# Altium schematic sheet Adafruit MCP9600.SchDoc: Adafruit MCP9600
size 282 x 211 mm; Origin: Eagle; OriginPath: C:\Users\pdreyer\Desktop\Personal Docs\Estiaan Skripsie\Altium\Imports\Adafruit MCP9600.sch; OriginSheet: 1; SheetNumber: 1; YEAR: YEAR; COMPANY: COMPANY; DRAWN: DRAWN; Date: 22/02/2025 20:53:53; REV: REV; GateName_1: G$1; SymbolName_1: FRAME_A4; LibraryName: microbuilder; DeviceSetName: FRAME_A4; GateName_2: G$3; SymbolName_2: FRAME_DOCFIELD; DRG: DRG; o: o; N: N; C: C; ISSUE: ISSUE; FILE: FILE:; PAGE: PAGE:; CHECKED: CHECKED; DRGNO: >DRGNO
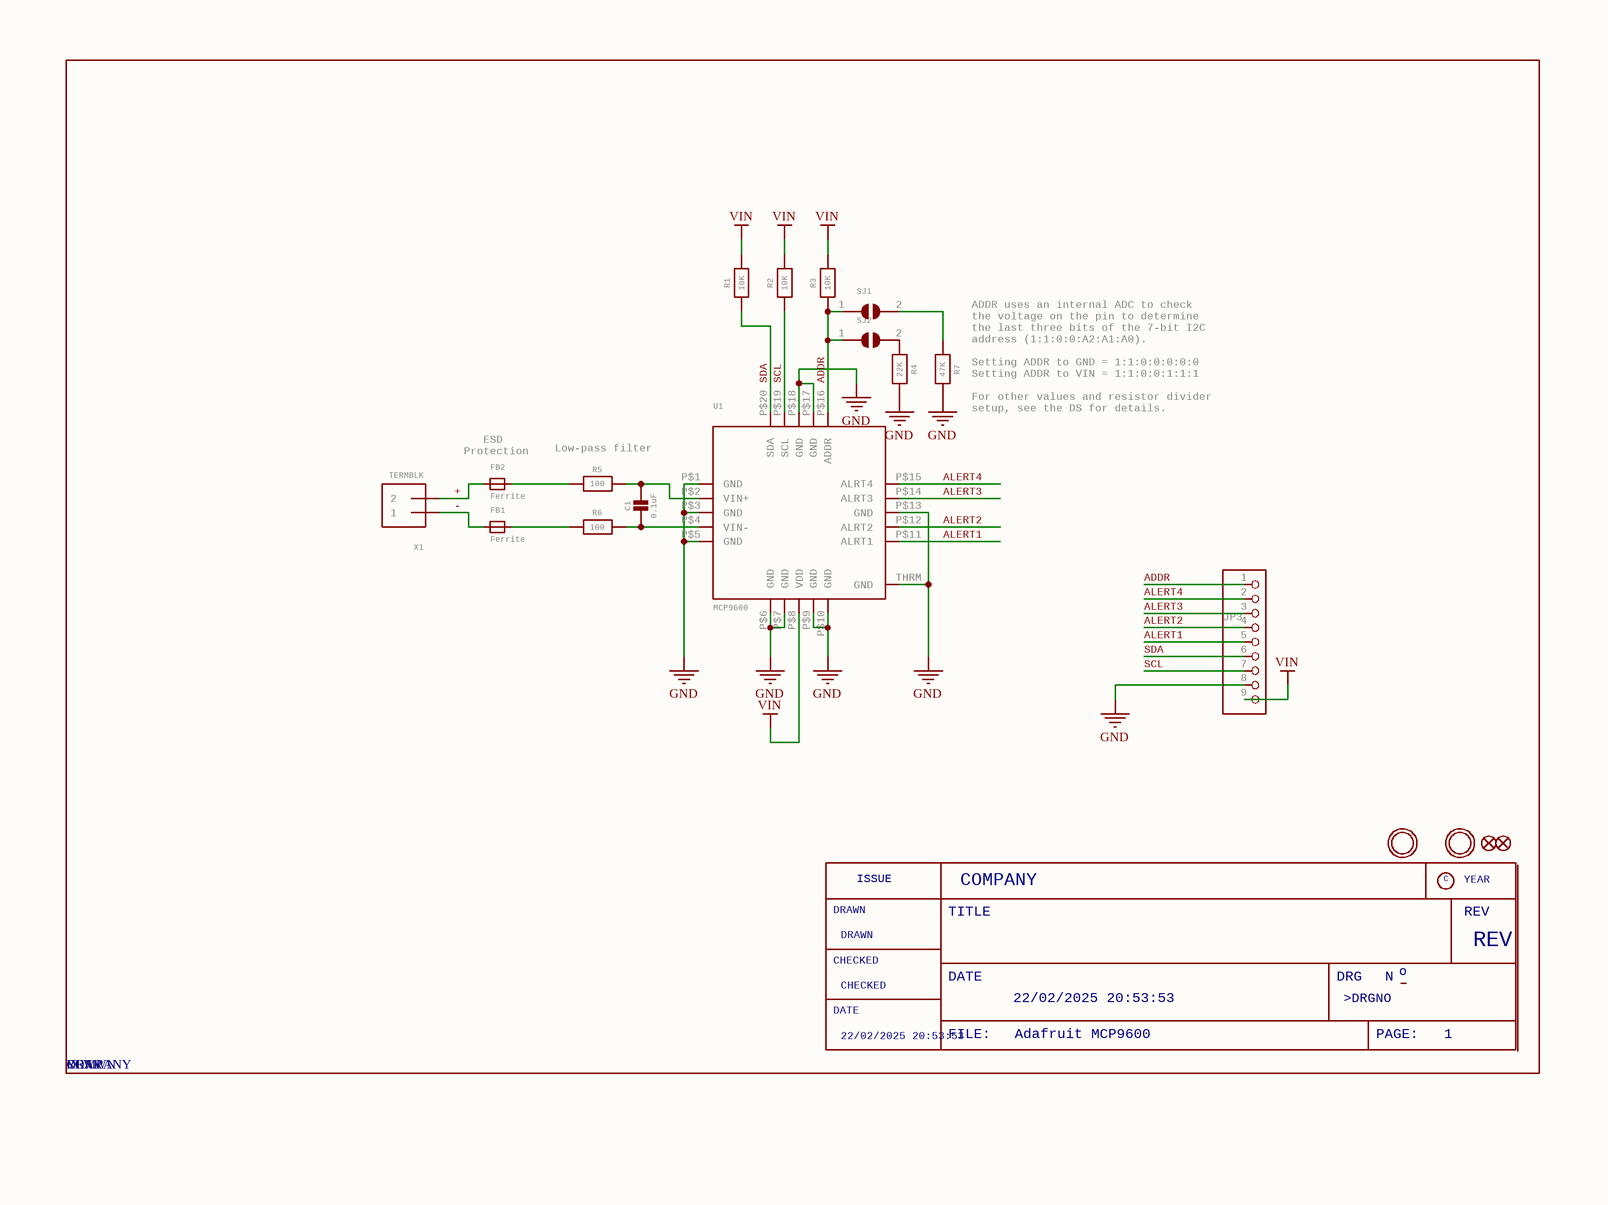
[diagram p0: Adafruit MCP9600.SchDoc]

## Parts
C1  0.1uF  [0603-NO]
FB1  Ferrite  [0805-NO]
FB2  Ferrite  [0805-NO]
FID1  FIDUCIAL_1MM  [FIDUCIAL_1MM]  (value not drawn)
FID2  FIDUCIAL_1MM  [FIDUCIAL_1MM]  (value not drawn)
JP3  HEADER-1X970MIL  [1X09_ROUND_70]  (value not drawn)
R1  10K  [0603-NO]
R2  10K  [0603-NO]
R3  10K  [0603-NO]
R4  22K  [0603-NO]
R5  100  [0603-NO]
R6  100  [0603-NO]
R7  47K  [0603-NO]
SJ1  SOLDERJUMPER  [SOLDERJUMPER_ARROW_NOPASTE]  (value not drawn)
SJ2  SOLDERJUMPER  [SOLDERJUMPER_ARROW_NOPASTE]  (value not drawn)
U1  MCP9600  [VQFN20_5MM]
U$1  MOUNTINGHOLE2.5  [MOUNTINGHOLE_2.5_PLATED]  (value not drawn)
U$3  MOUNTINGHOLE2.5  [MOUNTINGHOLE_2.5_PLATED]  (value not drawn)
X1  TERMBLK  [TERMBLOCK_1X2-3.5MM]

## Nets
GND: JP3.8 R4.2 R7.2 U1.P$1(GND) U1.P$3(GND) U1.P$5(GND) U1.P$6(GND) U1.P$7(GND) U1.P$9(GND) U1.P$10(GND) U1.P$13(GND) U1.P$17(GND) U1.P$18(GND) U1.THRM(GND)
VIN: JP3.9 R1.2 R2.2 R3.2 U1.P$8(VDD)
+: FB2.1(P$1) X1.2
-: FB1.1(P$1) X1.1
ADDR: JP3.1 R3.1 SJ1.1 SJ2.1 U1.P$16(ADDR)
ALERT1: JP3.5 U1.P$11(ALRT1)
ALERT2: JP3.4 U1.P$12(ALRT2)
ALERT3: JP3.3 U1.P$14(ALRT3)
ALERT4: JP3.2 U1.P$15(ALRT4)
SCL: JP3.7 R2.1 U1.P$19(SCL)
SDA: JP3.6 R1.1 U1.P$20(SDA)
NetC1_1: C1.1 R5.2 U1.P$2(VIN+)
NetC1_2: C1.2 R6.2 U1.P$4(VIN-)
NetFB1_2: FB1.2(P$2) R6.1
NetFB2_2: FB2.2(P$2) R5.1
NetR4_1: R4.1 SJ2.2
NetR7_1: R7.1 SJ1.2

## Notes on the sheet
- (near R7) ADDR uses an internal ADC to check
  the voltage on the pin to determine
  the last three bits of the 7-bit I2C
  address (1:1:0:0:A2:A1:A0).
  Setting ADDR to GND = 1:1:0:0:0:0:0
  Setting ADDR to VIN = 1:1:0:0:1:1:1
  For other values and resistor divider
  setup, see the DS for details.
- (near FB2) ESD
  Protection
- Low-pass filter
- DRAWN
- ISSUE
- TITLE
- COMPANY
- C
- REV
- YEAR
- CHECKED
- DATE
- 22/02/2025 20:53:53
- DRG
- >DRGNO
- N
- o
- FILE:
- Adafruit MCP9600
- PAGE:
- 1

## Library data of the parts
C1 = CAP_CERAMIC0603_NO: Ceramic Capacitors   For new designs, use the packages preceded by an '_' character since they are more reliable:   The following footprints should be used on most boards: _0402 - Standard footprint for regular board layouts  _0603 - Standard footprint for regular board layouts  _0805 - Standard footprint for regular board layouts  _1206 - Standard footprint for regular board layouts       For extremely tight-pitch boards where space is at a premium, the following 'micro-pitch' footprints can be used (smaller pads, no silkscreen outline, etc.): _0402MP - Micro-pitch footprint for very dense/compact boards  _0603MP - Micro-pitch footprint for very dense/compact boards  _0805MP - Micro-pitch footprint for very dense/compact boards  _1206MP - Micro-pitch footprint for very dense/compact boards; GateName_1: G$1; SymbolName_1: CAPACITOR; DeviceName: 0603_NO; LibraryName: microbuilder; DeviceSetName: CAP_CERAMIC
FB1 FB2 = FERRITE-0805NO: Ferrite Bead   0603 MMZ1608B121C - 120 Ohm @ 100MHz, 600mA, 0.15 Ohm DC Resistance - Digikey: 445-2164-1-ND  BK1608HW121-T - 120 Ohm, 600mA Ferrite Chip - Digikey: 587-1876-2-ND       0805 HZ0805B272R-10 - 2.7K Ohm @ 100MHz, 200mA, 0.8 Ohm DC Resistance - Digikey: 240-2504-1-ND (see also Murata BLM21BD272SN1L)  MMZ2012Y152B - 1.5K Ohm @ 100MHz, 500mA, 0.4 Ohm DC Resistance - Digikey: 445-1560-1-ND - Mainly for high frequency (80-400MHz)  MMZ2012R102A - 1K Ohm @ 100MHz, 500mA, 0.3 Ohm DC Resistance - Digikey: 445-1555-2-ND - More general purpose (10-200MHz); GateName_1: G$1; SymbolName_1: FERRITE; DeviceName: -0805NO; LibraryName: microbuilder; DeviceSetName: FERRITE
FID1 FID2 = FIDUCIAL_1MM: Fiducial Alignment Points   Various fiducial points for machine vision alignment.; GateName_1: G$1; DeviceName: _1MM; BOM: EXCLUDE; SymbolName_1: FIDUCIAL; LibraryName: microbuilder; DeviceSetName: FIDUCIAL
JP3 = HEADER-1X970MIL: PIN HEADER; GateName_1: A; SymbolName_1: PINHD9; DeviceName: 70MIL; LibraryName: microbuilder; DeviceSetName: HEADER-1X9
R1-R7 = RESISTOR_0603_NOOUT: Resistors   For new designs, use the packages preceded by an '_' character since they are more reliable:   The following footprints should be used on most boards: _0402 - Standard footprint for regular board layouts  _0603 - Standard footprint for regular board layouts  _0805 - Standard footprint for regular board layouts  _1206 - Standard footprint for regular board layouts       For extremely tight-pitch boards where space is at a premium, the following 'micro-pitch' footprints can be used (smaller pads, no silkscreen outline, etc.): _0402MP - Micro-pitch footprint for very dense/compact boards  _0603MP - Micro-pitch footprint for very dense/compact boards  _0805MP - Micro-pitch footprint for very dense/compact boards  _1206MP - Micro-pitch footprint for very dense/compact boards; GateName_1: G$1; SymbolName_1: RESISTOR; DeviceName: _0603_NOOUT; LibraryName: microbuilder; DeviceSetName: RESISTOR
SJ1 SJ2 = SOLDERJUMPER: SMD Solder JUMPER   Solder the two pads together to create a connection, or remove the solder to break it.REFLOW - Use this footprint for solder paste and reflow ovens. WAVE - Use this footprint for hand-soldering (larger pads).    CLOSED - Has a trace between the two pads to ensure it is closed by default.  The trace needs to be cut to disable the jumper, and can be closed again by creating a solder bridge between the two pads.; GateName_1: 1; BOM: EXCLUDE; SymbolName_1: SOLDERJUMPER; LibraryName: microbuilder; DeviceSetName: SOLDERJUMPER
U1 = MCP9600: MCP9600 -  I2C Thermocouple EMF to Temperature Converter Operating Voltage Range: 2.7V to 5.5V; GateName_1: G$1; SymbolName_1: MCP9600; LibraryName: microbuilder; DeviceSetName: MCP9600
U$1 U$3 = MOUNTINGHOLE2.5: Mounting Hole   For #2 screws (0.086"/2.18mm width, 0.094"/2.4mm hole) use 2.5mm; GateName_1: G$1; DeviceName: 2.5; BOM: EXCLUDE; SymbolName_1: MOUNTINGHOLE; LibraryName: microbuilder; DeviceSetName: MOUNTINGHOLE
X1 = TERMBLOCK_1X2_3.5MM: 3.5mm Terminal block    http://www.ladyada.net/library/pcb/eaglelibrary.html; GateName_1: G$1; SymbolName_1: 1X2; DeviceName: _3.5MM; LibraryName: microbuilder; DeviceSetName: TERMBLOCK_1X2